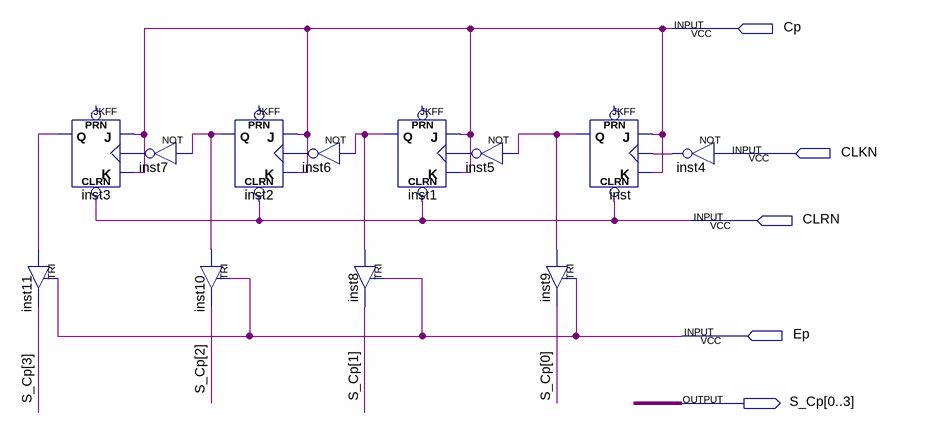
[diagram p0: schematic sheet]
// Quartus schematic Contador_Programa.bdf as structural Verilog: 12 symbols, 5 pins
module Contador_Programa (
  input  Cp,
  input  CLKN,
  input  CLRN,
  input  Ep,
  output [0:3] S_Cp
);

  wire inst1_q, inst2_q, inst3_q, inst4_out, inst5_out, inst6_out, inst7_out, inst_q;

  JKFF inst3 (.CLRN(CLRN), .K(Cp), .J(Cp), .CLK(inst7_out), .Q(inst3_q));  // open: PRN
  TRI inst11 (.IN(inst3_q), .OE(Ep), .OUT(S_Cp[3]));
  not inst7 (inst7_out, inst2_q);
  JKFF inst2 (.CLRN(CLRN), .K(Cp), .J(Cp), .CLK(inst6_out), .Q(inst2_q));  // open: PRN
  TRI inst10 (.IN(inst2_q), .OE(Ep), .OUT(S_Cp[2]));
  not inst6 (inst6_out, inst1_q);
  TRI inst8 (.IN(inst1_q), .OE(Ep), .OUT(S_Cp[1]));
  JKFF inst1 (.CLRN(CLRN), .K(Cp), .J(Cp), .CLK(inst5_out), .Q(inst1_q));  // open: PRN
  not inst5 (inst5_out, inst_q);
  JKFF inst (.CLRN(CLRN), .K(Cp), .J(Cp), .CLK(inst4_out), .Q(inst_q));  // open: PRN
  TRI inst9 (.IN(inst_q), .OE(Ep), .OUT(S_Cp[0]));
  not inst4 (inst4_out, CLKN);
endmodule
